# Altium schematic sheet MCU.SchDoc: Title
size A2; Date: Date; CompanyName: Integrated Micro-Electronics Bulgaria; Organization: Design & Development Department; Address1: Drawing Type; Address2: Address 1; Address3: Address 2; Address4: Address 3; DocumentNumber: 730xxx; Revision: 01; SheetNumber: 1; SheetTotal: 1; PageSetup: Record=PageOptions|CenterHorizontal=True|CenterVertical=True|PrintScale=0.70|XCorrection=1.00|YCorrection=1.00|PrintKind=2|BorderSize=5000000|LeftOffset=0|BottomOffset=0|Orientation=2|PaperLength=1000|PaperWidth=1000|Scale=100|PaperSource=7|PrintQuality=-4|MediaType=1|DitherType=10|PaperKind=A4|PrintScaleMode=1; SheetSize: A3; Time: Time; ModifiedDate: Mod. Date
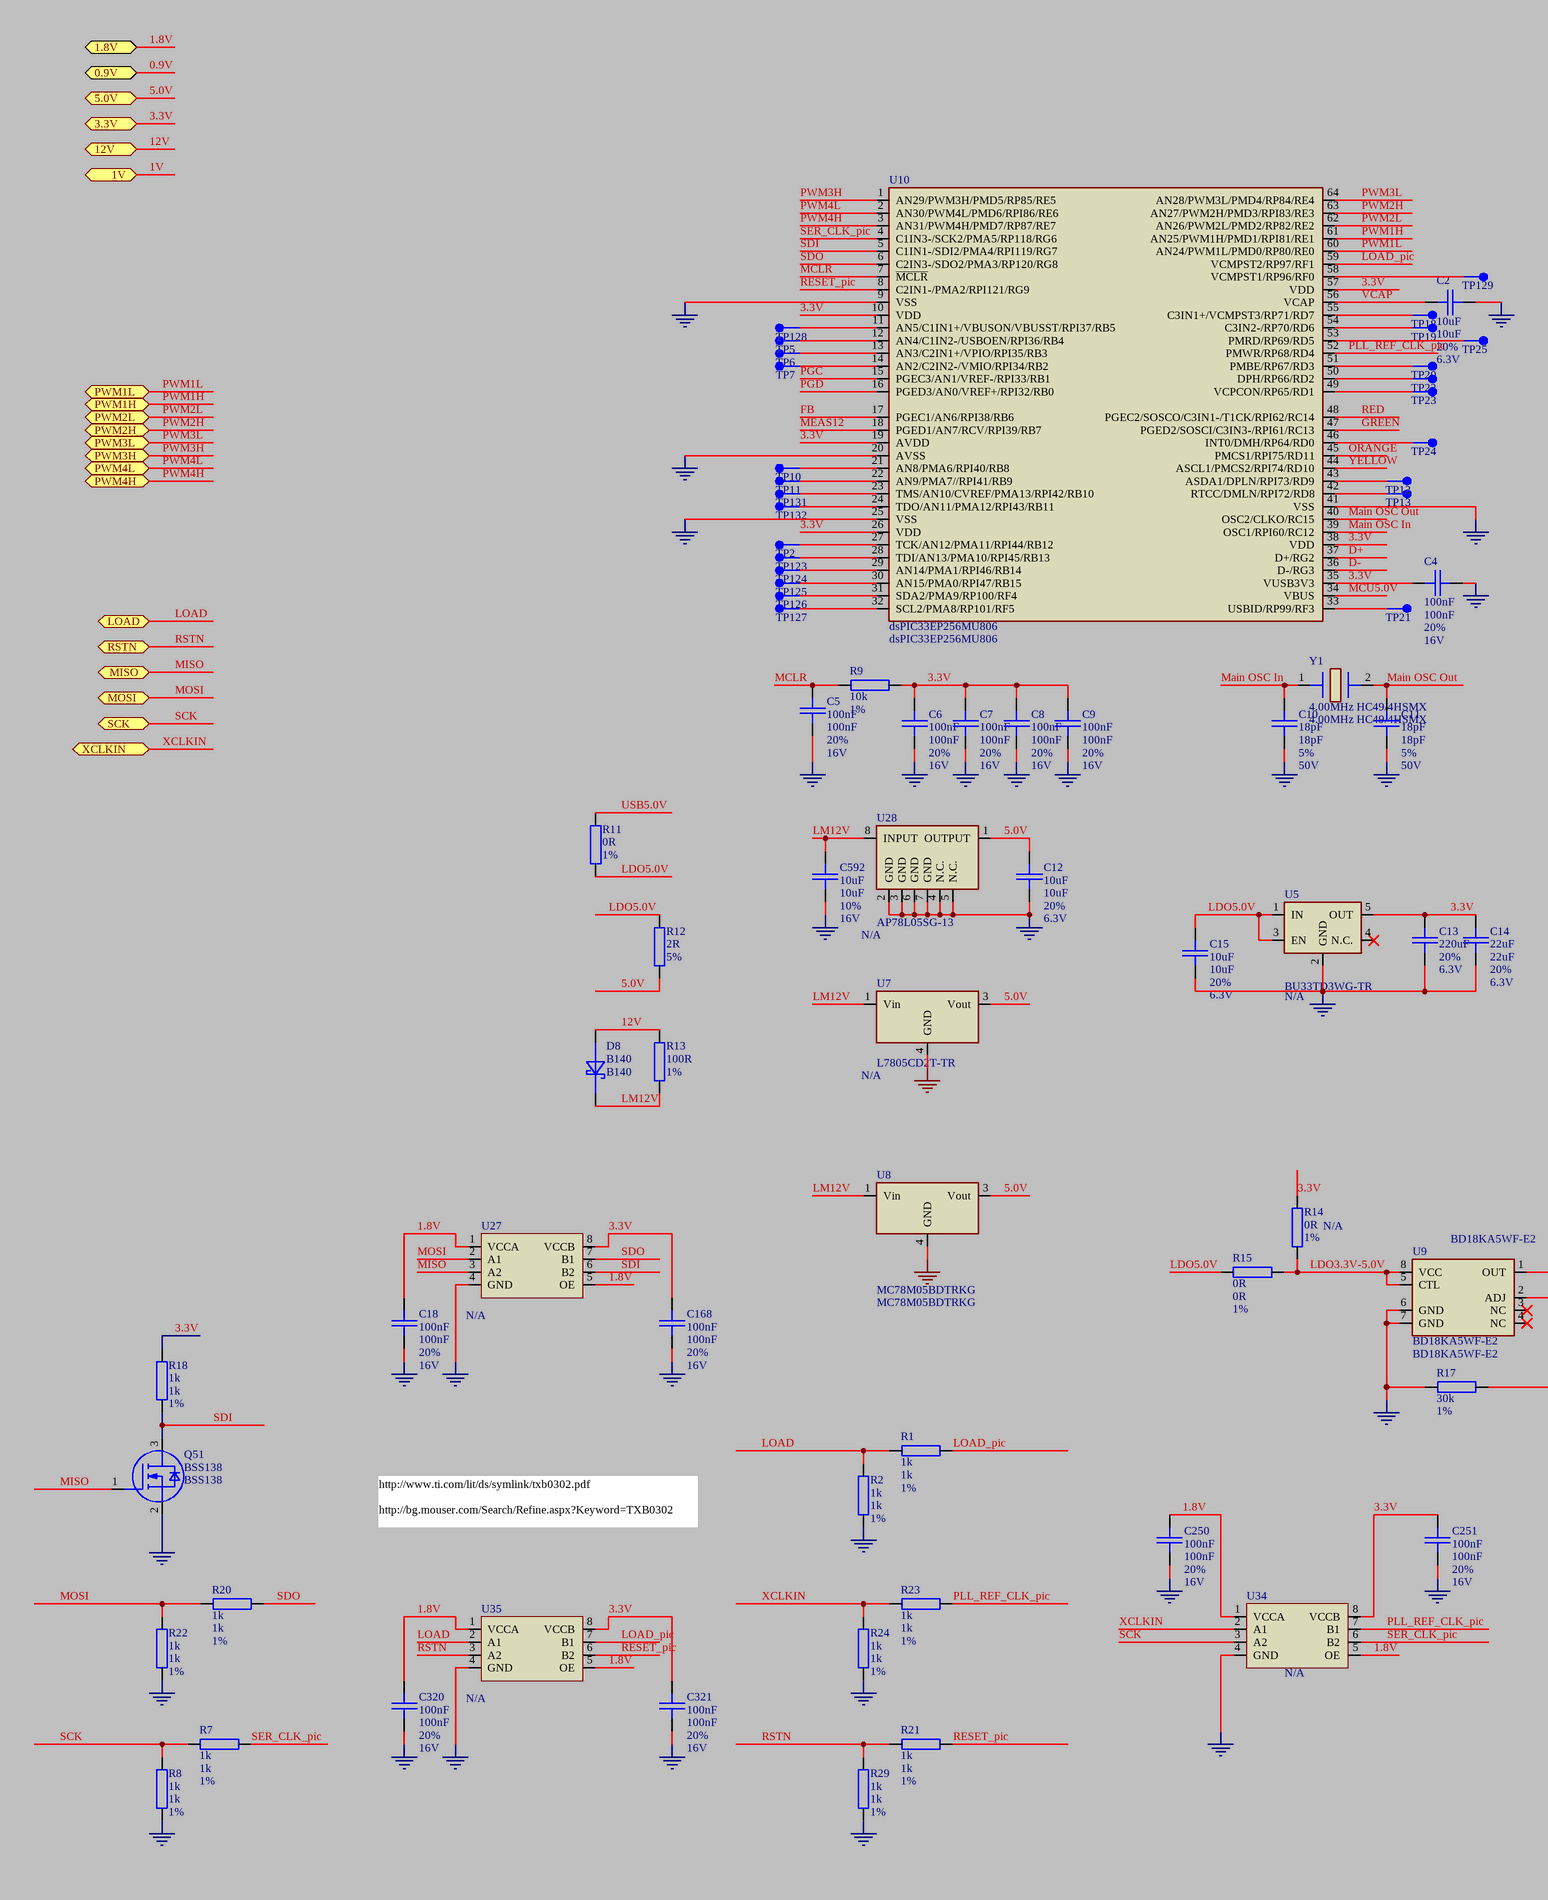
[diagram p0: MCU.SchDoc, left]
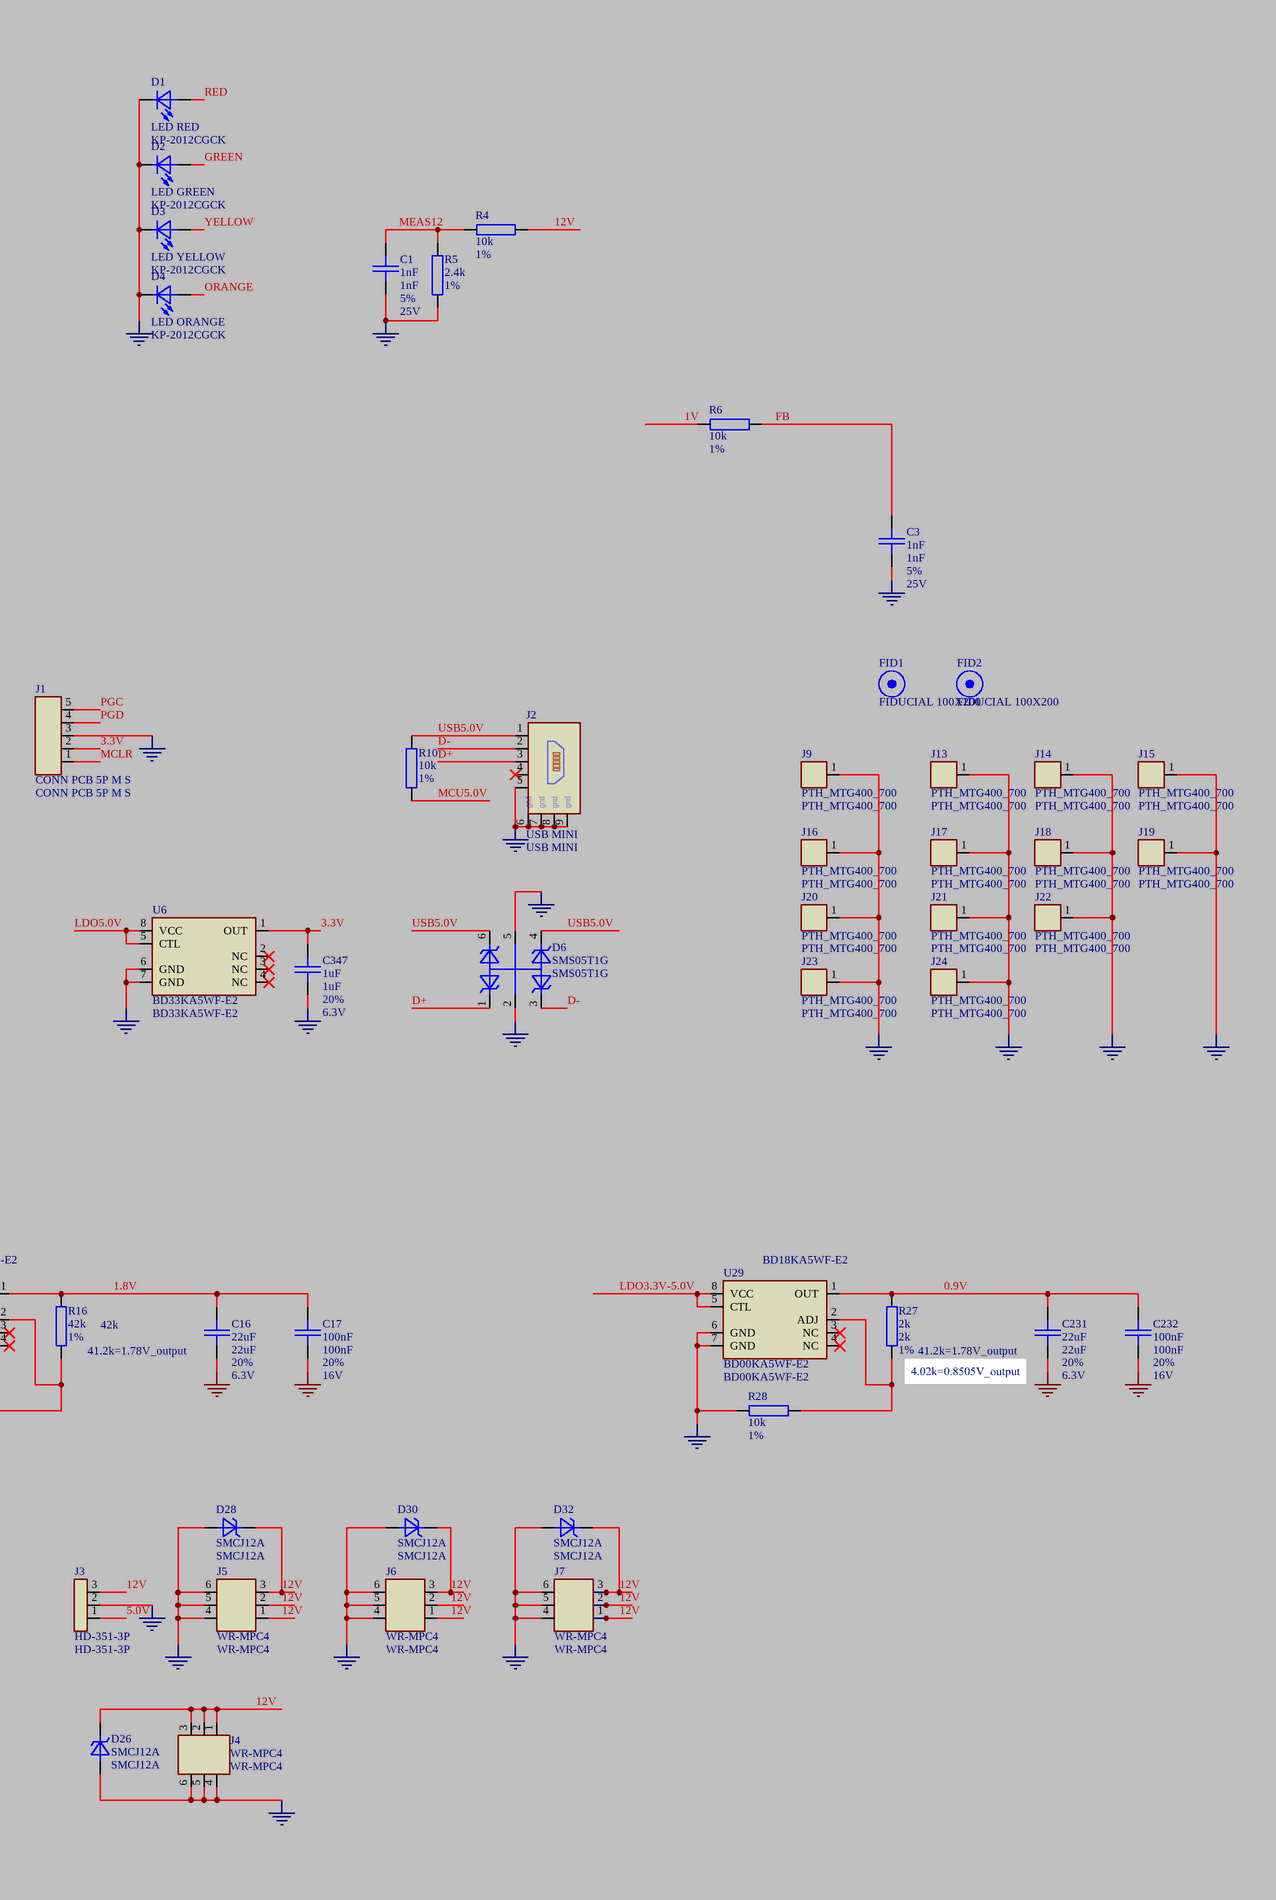
[diagram p1: MCU.SchDoc, right]

## Parts
C1  1nF  DB_TOLERANCE: 5%  DB_VOLTAGE: 25V  [SMD_0603_CAPC1608X95N]
C2  10uF  DB_TOLERANCE: 20%  DB_VOLTAGE: 6.3V  [SMD_0603_CAPC1608X95N]
C3  1nF  DB_TOLERANCE: 5%  DB_VOLTAGE: 25V  [SMD_0603_CAPC1608X95N]
C4  100nF  DB_TOLERANCE: 20%  DB_VOLTAGE: 16V  [SMD_0603_CAPC1608X95N]
C5  100nF  DB_TOLERANCE: 20%  DB_VOLTAGE: 16V  [SMD_0603_CAPC1608X95N]
C6  100nF  DB_TOLERANCE: 20%  DB_VOLTAGE: 16V  [SMD_0603_CAPC1608X95N]
C7  100nF  DB_TOLERANCE: 20%  DB_VOLTAGE: 16V  [SMD_0603_CAPC1608X95N]
C8  100nF  DB_TOLERANCE: 20%  DB_VOLTAGE: 16V  [SMD_0603_CAPC1608X95N]
C9  100nF  DB_TOLERANCE: 20%  DB_VOLTAGE: 16V  [SMD_0603_CAPC1608X95N]
C10  18pF  DB_TOLERANCE: 5%  DB_VOLTAGE: 50V  [SMD_0603_CAPC1608X95N]
C11  18pF  DB_TOLERANCE: 5%  DB_VOLTAGE: 50V  [SMD_0603_CAPC1608X95N]
C12  10uF  DB_TOLERANCE: 20%  DB_VOLTAGE: 6.3V  [SMD_0603_CAPC1608X95N]
C13  DB_TOLERANCE: 20%  DB_VOLTAGE: 6.3V  [SMD_1210_CAPC3225X279N]  (hidden comment: 220uF)
C14  22uF  DB_TOLERANCE: 20%  DB_VOLTAGE: 6.3V  [SMD_0805_CAPC2012X145N]
C15  10uF  DB_TOLERANCE: 20%  DB_VOLTAGE: 6.3V  [SMD_0603_CAPC1608X95N]
C16  22uF  DB_TOLERANCE: 20%  DB_VOLTAGE: 6.3V  [SMD_0805_CAPC2012X145N]
C17  100nF  DB_TOLERANCE: 20%  DB_VOLTAGE: 16V  [SMD_0603_CAPC1608X95N]
C18  100nF  DB_TOLERANCE: 20%  DB_VOLTAGE: 16V  [SMD_0603_CAPC1608X95N]
C168  100nF  DB_TOLERANCE: 20%  DB_VOLTAGE: 16V  [SMD_0603_CAPC1608X95N]
C231  22uF  DB_TOLERANCE: 20%  DB_VOLTAGE: 6.3V  [SMD_0805_CAPC2012X145N]
C232  100nF  DB_TOLERANCE: 20%  DB_VOLTAGE: 16V  [SMD_0603_CAPC1608X95N]
C250  100nF  DB_TOLERANCE: 20%  DB_VOLTAGE: 16V  [SMD_0603_CAPC1608X95N]
C251  100nF  DB_TOLERANCE: 20%  DB_VOLTAGE: 16V  [SMD_0603_CAPC1608X95N]
C320  100nF  DB_TOLERANCE: 20%  DB_VOLTAGE: 16V  [SMD_0603_CAPC1608X95N]
C321  100nF  DB_TOLERANCE: 20%  DB_VOLTAGE: 16V  [SMD_0603_CAPC1608X95N]
C347  1uF  DB_TOLERANCE: 20%  DB_VOLTAGE: 6.3V  [SMD_0603_CAPC1608X95N]
C592  10uF  DB_TOLERANCE: 10%  DB_VOLTAGE: 16V  [SMD_0805_CAPC2012X145N]
D1  LED RED  DB_VALUE: KP-2012CGCK  [SMD_0805_LED2012X100N]
D2  LED GREEN  DB_VALUE: KP-2012CGCK  [SMD_0805_LED2012X100N]
D3  LED YELLOW  DB_VALUE: KP-2012CGCK  [SMD_0805_LED2012X100N]
D4  LED ORANGE  DB_VALUE: KP-2012CGCK  [SMD_0805_LED2012X100N]
D6  SMS05T1G  [SMD_SOT457_SOT95P275X110-6N]
D8  B140  [SMD_DO214AC_SMA]
D26  SMCJ12A  [SMD_DO214AC_SMC]
D28  SMCJ12A  [SMD_DO214AC_SMC]
D30  SMCJ12A  [SMD_DO214AC_SMC]
D32  SMCJ12A  [SMD_DO214AC_SMC]
FID1  FIDUCIAL 100X200  [FID100X200]
FID2  FIDUCIAL 100X200  [FID100X200]
J1  CONN PCB 5P M S  [PTH_HDRV05W64P254_1X05]
J2  USB MINI  [SMD_CON-CVILUX-CU04-SCM15B0]
J3  HD-351-3P  [PTH_CON_HD-351-3P]
J4  WR-MPC4  [PTH_CON_WR-MRC4-6P]
J5  WR-MPC4  [PTH_CON_WR-MRC4-6P]
J6  WR-MPC4  [PTH_CON_WR-MRC4-6P]
J7  WR-MPC4  [PTH_CON_WR-MRC4-6P]
J9  PTH_MTG400_700  [PTH_MTG400_700]
J13  PTH_MTG400_700  [PTH_MTG400_700]
J14  PTH_MTG400_700  [PTH_MTG400_700]
J15  PTH_MTG400_700  [PTH_MTG400_700]
J16  PTH_MTG400_700  [PTH_MTG400_700]
J17  PTH_MTG400_700  [PTH_MTG400_700]
J18  PTH_MTG400_700  [PTH_MTG400_700]
J19  PTH_MTG400_700  [PTH_MTG400_700]
J20  PTH_MTG400_700  [PTH_MTG400_700]
J21  PTH_MTG400_700  [PTH_MTG400_700]
J22  PTH_MTG400_700  [PTH_MTG400_700]
J23  PTH_MTG400_700  [PTH_MTG400_700]
J24  PTH_MTG400_700  [PTH_MTG400_700]
Q51  BSS138  [SMD_SOT23_SOT95P240X112-3N]
R1  1k  DB_TOLERANCE: 1%  [SMD_0603_RESC1608X55N]
R2  1k  DB_TOLERANCE: 1%  [SMD_0603_RESC1608X55N]
R4  DB_TOLERANCE: 1%  [SMD_0603_RESC1608X55N]  (hidden comment: 10k)
R5  DB_TOLERANCE: 1%  [SMD_0603_RESC1608X55N]  (hidden comment: 2.4k)
R6  DB_TOLERANCE: 1%  [SMD_0603_RESC1608X55N]  (hidden comment: 10k)
R7  1k  DB_TOLERANCE: 1%  [SMD_0603_RESC1608X55N]
R8  1k  DB_TOLERANCE: 1%  [SMD_0603_RESC1608X55N]
R9  DB_TOLERANCE: 1%  [SMD_0603_RESC1608X55N]  (hidden comment: 10k)
R10  DB_TOLERANCE: 1%  [SMD_0603_RESC1608X55N]  (hidden comment: 10k)
R11  DB_TOLERANCE: 1%  [SMD_0603_RESC1608X55N]  (hidden comment: 0R)
R12  DB_TOLERANCE: 5%  [SMD_1206_RESC3216X65N]  (hidden comment: 2R)
R13  DB_TOLERANCE: 1%  [SMD_1206_RESC3216X65N]  (hidden comment: 100R)
R14  DB_TOLERANCE: 1%  [SMD_1206_RESC3216X65N]  (hidden comment: 0R)
R15  0R  DB_TOLERANCE: 1%  [SMD_1206_RESC3216X65N]
R16  DB_TOLERANCE: 1%  [SMD_0603_RESC1608X55N]  (hidden comment: 42k)
R17  DB_TOLERANCE: 1%  [SMD_0603_RESC1608X55N]  (hidden comment: 30k)
R18  1k  DB_TOLERANCE: 1%  [SMD_0603_RESC1608X55N]
R20  1k  DB_TOLERANCE: 1%  [SMD_0603_RESC1608X55N]
R21  1k  DB_TOLERANCE: 1%  [SMD_0603_RESC1608X55N]
R22  1k  DB_TOLERANCE: 1%  [SMD_0603_RESC1608X55N]
R23  1k  DB_TOLERANCE: 1%  [SMD_0603_RESC1608X55N]
R24  1k  DB_TOLERANCE: 1%  [SMD_0603_RESC1608X55N]
R27  2k  DB_TOLERANCE: 1%  [SMD_0603_RESC1608X55N]
R28  DB_TOLERANCE: 1%  [SMD_0603_RESC1608X55N]  (hidden comment: 10k)
R29  1k  DB_TOLERANCE: 1%  [SMD_0603_RESC1608X55N]
TP2  100_254  [SMD_TP_100-254]  (value not drawn)
TP5  100_254  [SMD_TP_100-254]  (value not drawn)
TP6  100_254  [SMD_TP_100-254]  (value not drawn)
TP7  100_254  [SMD_TP_100-254]  (value not drawn)
TP10  100_254  [SMD_TP_100-254]  (value not drawn)
TP11  100_254  [SMD_TP_100-254]  (value not drawn)
TP12  100_254  [SMD_TP_100-254]  (value not drawn)
TP13  100_254  [SMD_TP_100-254]  (value not drawn)
TP18  100_254  [SMD_TP_100-254]  (value not drawn)
TP19  100_254  [SMD_TP_100-254]  (value not drawn)
TP20  100_254  [SMD_TP_100-254]  (value not drawn)
TP21  100_254  [SMD_TP_100-254]  (value not drawn)
TP22  100_254  [SMD_TP_100-254]  (value not drawn)
TP23  100_254  [SMD_TP_100-254]  (value not drawn)
TP24  100_254  [SMD_TP_100-254]  (value not drawn)
TP25  100_254  [SMD_TP_100-254]  (value not drawn)
TP123  100_254  [SMD_TP_100-254]  (value not drawn)
TP124  100_254  [SMD_TP_100-254]  (value not drawn)
TP125  100_254  [SMD_TP_100-254]  (value not drawn)
TP126  100_254  [SMD_TP_100-254]  (value not drawn)
TP127  100_254  [SMD_TP_100-254]  (value not drawn)
TP128  100_254  [SMD_TP_100-254]  (value not drawn)
TP129  100_254  [SMD_TP_100-254]  (value not drawn)
TP131  100_254  [SMD_TP_100-254]  (value not drawn)
TP132  100_254  [SMD_TP_100-254]  (value not drawn)
U5  BU33TD3WG-TR  [SMD_SOT95P280X135-5N]
U6  BD33KA5WF-E2  [SMD_SOIC127P620X160-8N]
U7  L7805CD2T-TR  [SMD_TO254P1542X460-3_4N]
U8  MC78M05BDTRKG  [SMD_TO229P991X239-4N_DPAK]
U9  BD18KA5WF-E2  [SMD_SOIC127P620X160-8N]
U10  dsPIC33EP256MU806  [SMD_QFP50P1200X1200X120-64N]
U27  (no value)  [SMD_PSON40P120X180X40-8N]
U28  AP78L05SG-13  [SMD_SOIC127P600X175-8N]
U29  BD00KA5WF-E2  [SMD_SOIC127P620X160-8N]
U34  (no value)  [SMD_PSON40P120X180X40-8N]
U35  (no value)  [SMD_PSON40P120X180X40-8N]
Y1  4.00MHz HC49/4HSMX  [SMD_HC49_XTAL1140X480X420N]

## Ports
0.9V, 1.8V, 1V, 3.3V, 5.0V, 12V, LOAD, MISO, MOSI, PWM1H, PWM1L, PWM2H, PWM2L, PWM3H, PWM3L, PWM4H, PWM4L, RSTN, SCK, XCLKIN

## Nets
GND: C1.2 C2.2 C3.2 C4.2 C5.2 C6.2 C7.2 C8.2 C9.2 C10.2 C11.2 C12.2 C13.1 C14.2 C15.2 C16.2 C17.2 C18.1 C168.1 C231.2 C232.2 C250.1 C251.1 C320.1 C321.1 C347.2 C592.2 D1.1(C) D2.1(C) D3.1(C) D4.1(C) D6.2 D6.5 D26.2(A) D28.2(A) D30.2(A) D32.2(A) J1.3 J2.5 J2.6 J2.7 J2.8 J2.9 J3.2 J4.4 J4.5 J4.6 J5.4 J5.5 J5.6 J6.4 J6.5 J6.6 J7.4 J7.5 J7.6 J9.1 J13.1 J14.1 J15.1 J16.1 J17.1 J18.1 J19.1 J20.1 J21.1 J22.1 J23.1 J24.1 Q51.2(S) R2.2 R5.1 R8.2 R17.2 R22.2 R24.2 R28.2 R29.2 U5.2(GND) U6.6(GND) U6.7(GND) U7.4(GND) U8.4(GND) U9.6(GND) U9.7(GND) U10.9(VSS) U10.20(AVSS) U10.25(VSS) U10.41(VSS) U27.4(GND) U28.2(GND) U28.3(GND) U28.4(N.C.) U28.5(N.C.) U28.6(GND) U28.7(GND) U29.6(GND) U29.7(GND) U34.4(GND) U35.4(GND)
0.9V: C231.1 C232.1 R27.1 U29.1(OUT) ; port 0.9V
1.8V: C16.1 C17.1 C18.2 C250.2 C320.2 R16.1 U9.1(OUT) U27.1(VCCA) U27.5(OE) U34.1(VCCA) U34.5(OE) U35.1(VCCA) U35.5(OE) ; port 1.8V
1V: R6.2 ; port 1V
3.3V: C4.1 C6.1 C7.1 C8.1 C9.1 C13.2 C14.1 C168.2 C251.2 C321.2 C347.1 J1.2 R9.2 R14.2 R18.1 U5.5(OUT) U6.1(OUT) U10.10(VDD) U10.19(AVDD) U10.26(VDD) U10.35(VUSB3V3) U10.38(VDD) U10.57(VDD) U27.8(VCCB) U34.8(VCCB) U35.8(VCCB) ; port 3.3V
5.0V: C12.1 J3.1 R12.1 U7.3(Vout) U8.3(Vout) U28.1(OUTPUT) ; port 5.0V
12V: D8.2(A) D26.1(C) D28.1(C) D30.1(C) D32.1(C) J3.3 J4.1 J4.2 J4.3 J5.1 J5.2 J5.3 J6.1 J6.2 J6.3 J7.1 J7.2 J7.3 R4.1 R13.2 ; port 12V
D+: D6.1 J2.3 U10.37(D+/RG2)
D-: D6.3 J2.2 U10.36(D-/RG3)
FB: C3.1 R6.1 U10.17(PGEC1/AN6/RPI38/RB6)
GREEN: D2.2(A) U10.47(PGED2/SOSCI/C3IN3-/RPI61/RC13)
LDO3.3V-5.0V: R14.1 R15.1 U9.5(CTL) U9.8(VCC) U29.5(CTL) U29.8(VCC)
LDO5.0V: C15.1 R11.1 R12.2 R15.2 U5.1(IN) U5.3(EN) U6.5(CTL) U6.8(VCC)
LM12V: C592.1 D8.1(C) R13.1 U7.1(Vin) U8.1(Vin) U28.8(INPUT)
LOAD: R1.1 R2.1 U35.2(A1) ; port LOAD
LOAD_pic: R1.2 U10.59(VCMPST2/RP97/RF1) U35.7(B1)
Main OSC In: C10.1 U10.39(OSC1/RPI60/RC12) Y1.1
Main OSC Out: C11.1 U10.40(OSC2/CLKO/RC15) Y1.2
MCLR: C5.1 J1.1 R9.1 U10.7(~{MCLR})
MCU5.0V: R10.2 U10.34(VBUS)
MEAS12: C1.1 R4.2 R5.2 U10.18(PGED1/AN7/RCV/RPI39/RB7)
MISO: Q51.1(G) U27.3(A2) ; port MISO
MOSI: R20.1 R22.1 U27.2(A1) ; port MOSI
ORANGE: D4.2(A) U10.45(PMCS1/RPI75/RD11)
PGC: J1.5 U10.15(PGEC3/AN1/VREF-/RPI33/RB1)
PGD: J1.4 U10.16(PGED3/AN0/VREF+/RPI32/RB0)
PLL_REF_CLK_pic: R23.2 U10.52(PMWR/RP68/RD4) U34.7(B1)
PWM1H: U10.61(AN25/PWM1H/PMD1/RPI81/RE1) ; port PWM1H
PWM1L: U10.60(AN24/PWM1L/PMD0/RP80/RE0) ; port PWM1L
PWM2H: U10.63(AN27/PWM2H/PMD3/RPI83/RE3) ; port PWM2H
PWM2L: U10.62(AN26/PWM2L/PMD2/RP82/RE2) ; port PWM2L
PWM3H: U10.1(AN29/PWM3H/PMD5/RP85/RE5) ; port PWM3H
PWM3L: U10.64(AN28/PWM3L/PMD4/RP84/RE4) ; port PWM3L
PWM4H: U10.3(AN31/PWM4H/PMD7/RP87/RE7) ; port PWM4H
PWM4L: U10.2(AN30/PWM4L/PMD6/RPI86/RE6) ; port PWM4L
RED: D1.2(A) U10.48(PGEC2/SOSCO/C3IN1-/T1CK/RPI62/RC14)
RESET_pic: R21.2 U10.8(C2IN1-/PMA2/RPI121/RG9) U35.6(B2)
RSTN: R21.1 R29.1 U35.3(A2) ; port RSTN
SCK: R7.1 R8.1 U34.3(A2) ; port SCK
SDI: Q51.3(D) R18.2 U10.5(C1IN1-/SDI2/PMA4/RPI119/RG7) U27.6(B2)
SDO: R20.2 U10.6(C2IN3-/SDO2/PMA3/RP120/RG8) U27.7(B1)
SER_CLK_pic: R7.2 U10.4(C1IN3-/SCK2/PMA5/RP118/RG6) U34.6(B2)
USB5.0V: D6.4 D6.6 J2.1 R10.1 R11.2
VCAP: C2.1 U10.56(VCAP)
XCLKIN: R23.1 R24.1 U34.2(A1) ; port XCLKIN
YELLOW: D3.2(A) U10.44(ASCL1/PMCS2/RPI74/RD10)
NetR16_2: R16.2 R17.1 U9.2(ADJ)
NetR27_2: R27.2 R28.1 U29.2(ADJ)
NetTP2_1: TP2.1 U10.27(TCK/AN12/PMA11/RPI44/RB12)
NetTP5_1: TP5.1 U10.12(AN4/C1IN2-/USBOEN/RPI36/RB4)
NetTP6_1: TP6.1 U10.13(AN3/C2IN1+/VPIO/RPI35/RB3)
NetTP7_1: TP7.1 U10.14(AN2/C2IN2-/VMIO/RPI34/RB2)
NetTP10_1: TP10.1 U10.21(AN8/PMA6/RPI40/RB8)
NetTP11_1: TP11.1 U10.22(AN9/PMA7//RPI41/RB9)
NetTP12_1: TP12.1 U10.43(ASDA1/DPLN/RPI73/RD9)
NetTP13_1: TP13.1 U10.42(RTCC/DMLN/RPI72/RD8)
NetTP18_1: TP18.1 U10.55(C3IN1+/VCMPST3/RP71/RD7)
NetTP19_1: TP19.1 U10.54(C3IN2-/RP70/RD6)
NetTP20_1: TP20.1 U10.51(PMBE/RP67/RD3)
NetTP21_1: TP21.1 U10.33(USBID/RP99/RF3)
NetTP22_1: TP22.1 U10.50(DPH/RP66/RD2)
NetTP23_1: TP23.1 U10.49(VCPCON/RP65/RD1)
NetTP24_1: TP24.1 U10.46(INT0/DMH/RP64/RD0)
NetTP25_1: TP25.1 U10.53(PMRD/RP69/RD5)
NetTP123_1: TP123.1 U10.28(TDI/AN13/PMA10/RPI45/RB13)
NetTP124_1: TP124.1 U10.29(AN14/PMA1/RPI46/RB14)
NetTP125_1: TP125.1 U10.30(AN15/PMA0/RPI47/RB15)
NetTP126_1: TP126.1 U10.31(SDA2/PMA9/RP100/RF4)
NetTP127_1: TP127.1 U10.32(SCL2/PMA8/RP101/RF5)
NetTP128_1: TP128.1 U10.11(AN5/C1IN1+/VBUSON/VBUSST/RPI37/RB5)
NetTP129_1: TP129.1 U10.58(VCMPST1/RP96/RF0)
NetTP131_1: TP131.1 U10.23(TMS/AN10/CVREF/PMA13/RPI42/RB10)
NetTP132_1: TP132.1 U10.24(TDO/AN11/PMA12/RPI43/RB11)

Not connected (* = marked no-connect by the designer): J2 4*; U5 4(N.C.)*; U6 2(NC)* 3(NC)* 4(NC)*; U9 3(NC)* 4(NC)*; U29 3(NC)* 4(NC)*

## Notes on the sheet
- (near U9) BD18KA5WF-E2
- (near U29) BD18KA5WF-E2
- (near R16) 42k
- 41.2k=1.78V_output
- http://www.ti.com/lit/ds/symlink/txb0302.pdf
  http://bg.mouser.com/Search/Refine.aspx?Keyword=TXB0302
- (in symbol CON000000048) gnd

## Library data of the parts
C1 C3 = CAP000024113: DB_PART_TYPE: Ceramic_SMD\Standard_X7R; DB_MANUFACTURER_PART: KEMET    C0603C102J3RAC; NOTE: <NOTE>; DB_T_RANGE: -55 to 125; DB_PACKAGE: 0603; DB_DESCRIPTION: C X7R 1nF 5% 25V 0603; DB_CERTIFIED: ISHIDDEN=T; DB_APPROVED_ON: 09.10.2010 г.; DB_STATUS: NEW; DB_PART_NUMBER: CAP000024113; DB_VALUE: 1nF; DB_PCB_DEVICE: SMD_0603_CAPC1608X95N; DB_PRICE: ISHIDDEN=T; DB_LEADTIME: ISHIDDEN=T; DB_MOQ: ISHIDDEN=T; DB_PRICE_DATE: ISHIDDEN=T; DB_APPROVED_BY: ISHIDDEN=T; DB_DATASHEET: http://john.epiqdesign.com/projects/CIS_Datasheets/F3102_CE_Kemet.pdf?rev=92&sc=0
C2 C12 C15 = CAP000043646: DB_MANUFACTURER_PART: KEMET    C0603C106M9PAC; DB_PART_TYPE: Ceramic_SMD\Standard_X5R; NOTE: <NOTE>; DB_APPROVED_BY: ISHIDDEN=T; DB_APPROVED_ON: 09.10.2010 г.; DB_DESCRIPTION: C X5R 10uF 20% 6.3V 0603; DB_PACKAGE: 0603; DB_STATUS: NEW; DB_T_RANGE: -55 to 85; DB_PART_NUMBER: CAP000043646; DB_VALUE: 10uF; DB_CERTIFIED: ISHIDDEN=T; DB_DATASHEET: http://john.epiqdesign.com/projects/CIS_Datasheets/F3102_CE_Kemet.pdf?rev=92&sc=0; DB_LEADTIME: ISHIDDEN=T; DB_MOQ: ISHIDDEN=T; DB_PCB_DEVICE: SMD_0603_CAPC1608X95N; DB_PRICE: ISHIDDEN=T; DB_PRICE_DATE: ISHIDDEN=T
C4-C9 C17 C18 C168 C232 C250 C251 C320 C321 = CAP000027236: DB_MANUFACTURER_PART: KEMET    C0603C104M4RAC; DB_PART_TYPE: Ceramic_SMD\Standard_X7R; NOTE: <NOTE>; DB_APPROVED_BY: ISHIDDEN=T; DB_APPROVED_ON: 09.10.2010 г.; DB_DESCRIPTION: C X7R 100nF 20% 16V 0603; DB_PACKAGE: 0603; DB_STATUS: NEW; DB_T_RANGE: -55 to 125; DB_PART_NUMBER: CAP000027236; DB_VALUE: 100nF; DB_CERTIFIED: ISHIDDEN=T; DB_DATASHEET: http://john.epiqdesign.com/projects/CIS_Datasheets/F3102_CE_Kemet.pdf?rev=92&sc=0; DB_LEADTIME: ISHIDDEN=T; DB_MOQ: ISHIDDEN=T; DB_PCB_DEVICE: SMD_0603_CAPC1608X95N; DB_PRICE: ISHIDDEN=T; DB_PRICE_DATE: ISHIDDEN=T
C10 C11 = CAP000031922: DB_PART_TYPE: Ceramic_SMD\Standard_C0G; DB_MANUFACTURER_PART: KEMET    C0603C180J5GAC; NOTE: <NOTE>; DB_T_RANGE: -55 to 125; DB_PACKAGE: 0603; DB_DESCRIPTION: C C0G 18pF 5% 50V 0603; DB_CERTIFIED: ISHIDDEN=T; DB_APPROVED_ON: 09.10.2010 г.; DB_STATUS: NEW; DB_PART_NUMBER: CAP000031922; DB_VALUE: 18pF; DB_PCB_DEVICE: SMD_0603_CAPC1608X95N; DB_PRICE: ISHIDDEN=T; DB_LEADTIME: ISHIDDEN=T; DB_MOQ: ISHIDDEN=T; DB_PRICE_DATE: ISHIDDEN=T; DB_APPROVED_BY: ISHIDDEN=T; DB_DATASHEET: http://john.epiqdesign.com/projects/CIS_Datasheets/F3102_CE_Kemet.pdf?rev=92&sc=0
C13 = CAP000047355: DB_PART_TYPE: Ceramic_SMD\Standard_X5R; DB_MANUFACTURER_PART: SAMSUNG    CL32A227MQVNNNE; NOTE: <NOTE>; DB_T_RANGE: -55 to 85; DB_PACKAGE: 1210; DB_DESCRIPTION: C X5R 220uF 20% 6.3V 1210; DB_CERTIFIED: ISHIDDEN=T; DB_APPROVED_BY: VSN; DB_APPROVED_ON: 07.5.2014 г. 11:28:08; DB_STATUS: NEW; DB_PART_NUMBER: CAP000047355; DB_VALUE: 220uF; DB_PCB_DEVICE: SMD_1210_CAPC3225X279N; DB_DATASHEET: http://john.epiqdesign.com/projects/CIS_Datasheets/CAP_CL32A227MQVNNNE.pdf?rev=1401&sc=0
C14 C16 C231 = CAP000043686: DB_PART_TYPE: Ceramic_SMD\Standard_X5R; DB_MANUFACTURER_PART: KEMET    C0805C226M9PAC; NOTE: <NOTE>; DB_T_RANGE: -55 to 85; DB_PACKAGE: 0805; DB_DESCRIPTION: C X5R 22uF 20% 6.3V 0805; DB_CERTIFIED: ISHIDDEN=T; DB_APPROVED_ON: 09.10.2010 г.; DB_STATUS: NEW; DB_PART_NUMBER: CAP000043686; DB_VALUE: 22uF; DB_PCB_DEVICE: SMD_0805_CAPC2012X145N; DB_PRICE: ISHIDDEN=T; DB_LEADTIME: ISHIDDEN=T; DB_MOQ: ISHIDDEN=T; DB_PRICE_DATE: ISHIDDEN=T; DB_APPROVED_BY: ISHIDDEN=T; DB_DATASHEET: http://john.epiqdesign.com/projects/CIS_Datasheets/F3102_CE_Kemet.pdf?rev=92&sc=0
C347 = CAP000043344: DB_PART_TYPE: Ceramic_SMD\Standard_X5R; DB_MANUFACTURER_PART: KEMET    C0603C105M9PAC; NOTE: <NOTE>; DB_T_RANGE: -55 to 85; DB_PACKAGE: 0603; DB_DESCRIPTION: C X5R 1uF 20% 6.3V 0603; DB_CERTIFIED: ISHIDDEN=T; DB_APPROVED_ON: 09.10.2010 г.; DB_STATUS: NEW; DB_PART_NUMBER: CAP000043344; DB_VALUE: 1uF; DB_PCB_DEVICE: SMD_0603_CAPC1608X95N; DB_PRICE: ISHIDDEN=T; DB_LEADTIME: ISHIDDEN=T; DB_MOQ: ISHIDDEN=T; DB_PRICE_DATE: ISHIDDEN=T; DB_APPROVED_BY: ISHIDDEN=T; DB_DATASHEET: http://john.epiqdesign.com/projects/CIS_Datasheets/F3102_CE_Kemet.pdf?rev=92&sc=0
C592 = CAP000043636: DB_PART_TYPE: Ceramic_SMD\Standard_X5R; DB_MANUFACTURER_PART: KEMET    C0805C106K4PAC; NOTE: <NOTE>; DB_T_RANGE: -55 to 85; DB_PACKAGE: 0805; DB_DESCRIPTION: C X5R 10uF 10% 16V 0805; DB_CERTIFIED: ISHIDDEN=T; DB_APPROVED_ON: 09.10.2010 г.; DB_STATUS: NEW; DB_PART_NUMBER: CAP000043636; DB_VALUE: 10uF; DB_PCB_DEVICE: SMD_0805_CAPC2012X145N; DB_PRICE: ISHIDDEN=T; DB_LEADTIME: ISHIDDEN=T; DB_MOQ: ISHIDDEN=T; DB_PRICE_DATE: ISHIDDEN=T; DB_APPROVED_BY: ISHIDDEN=T; DB_DATASHEET: http://john.epiqdesign.com/projects/CIS_Datasheets/F3102_CE_Kemet.pdf?rev=92&sc=0
D1 D3 D4 = OPT000000096: DB_MANUFACTURER_PART: KINGBRIGHT       KP-2012CGCK; NOTE: <NOTE>; DB_T_RANGE: -40 to 85; DB_COLOUR: GREEN; DB_PACKAGE: 0805; DB_DESCRIPTION: LED GREEN 0805; DB_CERTIFIED: ISHIDDEN=T; DB_APPROVED_BY: VSN; DB_APPROVED_ON: 08.4.2014 г. 09:22:12; DB_STATUS: NEW; DB_PCB_DEVICE: SMD_0805_LED2012X100N; DB_PART_NUMBER: OPT000000096; DB_PART_TYPE: LED; DB_DATASHEET: http://john.epiqdesign.com/projects/CIS_Datasheets/LED_KP-2012CGCK_0805_GREEN.pdf?rev=1359&sc=0
D2 = OPT000000096: DB_MANUFACTURER_PART: KINGBRIGHT       KP-2012CGCK; NOTE: <NOTE>; DB_T_RANGE: -40 to 85; DB_PACKAGE: 0805; DB_DESCRIPTION: LED GREEN 0805; DB_CERTIFIED: ISHIDDEN=T; DB_APPROVED_BY: VSN; DB_APPROVED_ON: 08.4.2014 г. 09:22:12; DB_STATUS: NEW; DB_PCB_DEVICE: SMD_0805_LED2012X100N; DB_PART_NUMBER: OPT000000096; DB_PART_TYPE: LED; DB_COLOUR: GREEN; DB_DATASHEET: http://john.epiqdesign.com/projects/CIS_Datasheets/LED_KP-2012CGCK_0805_GREEN.pdf?rev=1359&sc=0
D6 = DDE000002846: DB_PART_TYPE: ESD protection; DB_MANUFACTURER_PART: ON SEMICONDUCTOR        SMS05T1G; DB_T_RANGE: -55 to 150; DB_VOLTAGE: 5V; DB_PACKAGE: SC-74; DB_DESCRIPTION: D SMS05T1G SC-74; DB_CERTIFIED: ISHIDDEN=T; DB_APPROVED_BY: VSN; DB_APPROVED_ON: 24.3.2014 г. 10:22:08; DB_STATUS: NEW; DB_PART_NUMBER: DDE000002846; DB_VALUE: SMS05T1G; DB_PCB_DEVICE: SMD_SOT457_SOT95P275X110-6N; DB_DATASHEET: http://john.epiqdesign.com/projects/CIS_Datasheets/IC_SMS05T1-D.pdf?rev=1323&sc=0
D8 = DDE000000580: DB_PART_TYPE: Schottky; DB_MANUFACTURER_PART: Diodes        B140; NOTE: <NOTE>; DB_T_RANGE: -65 to +150; DB_VOLTAGE: 40V; DB_CURRENT: 1A; DB_PACKAGE: SMA; DB_DESCRIPTION: D B140 SMA; DB_CERTIFIED: ISHIDDEN=T; DB_APPROVED_ON: 09.10.2010 г.; DB_STATUS: NEW; DB_PART_NUMBER: DDE000000580; DB_VALUE: B140; DB_PCB_DEVICE: SMD_DO214AC_SMA; DB_PRICE: ISHIDDEN=T; DB_LEADTIME: ISHIDDEN=T; DB_MOQ: ISHIDDEN=T; DB_PRICE_DATE: ISHIDDEN=T; DB_APPROVED_BY: ISHIDDEN=T; DB_DATASHEET: ISHIDDEN=T
D26 D28 D30 D32 = DDE000001725: DB_PART_TYPE: TVS; DB_MANUFACTURER_PART: Diodes        SMCJ12A; NOTE: <NOTE>; DB_T_RANGE: -55 to 150; DB_VOLTAGE: 12V; DB_CURRENT: 75A(Max); DB_PACKAGE: SMC; DB_DESCRIPTION: D SMCJ12A SMC; DB_CERTIFIED: ISHIDDEN=T; DB_APPROVED_ON: 09.10.2010 г.; DB_STATUS: NEW; DB_PART_NUMBER: DDE000001725; DB_VALUE: SMCJ12A; DB_PCB_DEVICE: SMD_DO214AC_SMC; DB_PRICE: ISHIDDEN=T; DB_LEADTIME: ISHIDDEN=T; DB_MOQ: ISHIDDEN=T; DB_PRICE_DATE: ISHIDDEN=T; DB_APPROVED_BY: ISHIDDEN=T; DB_DATASHEET: ISHIDDEN=T
FID1 FID2 = FID000000001: NOTE: <NOTE>; DB_PACKAGE: ISHIDDEN=T; DB_APPROVED_ON: 10.9.2010 г.; DB_STATUS: NEW; DB_PART_NUMBER: FID000000001; DB_PART_TYPE: FIDUCIAL; DB_VALUE: FIDUCIAL 100X200; DB_DIAMETER: 100X200; DB_DESCRIPTION: FIDUCIAL 100x200; DB_PCB_DEVICE: FID100X200; DB_MANUFACTURER_PART: ISHIDDEN=T; DB_CERTIFIED: ISHIDDEN=T; DB_PRICE: ISHIDDEN=T; DB_LEADTIME: ISHIDDEN=T; DB_MOQ: ISHIDDEN=T; DB_PRICE_DATE: ISHIDDEN=T; DB_APPROVED_BY: ISHIDDEN=T; DB_DATASHEET: ISHIDDEN=T
J1 = CON000000006: DB_PART_TYPE: Connector; DB_MANUFACTURER_PART: W+P        143-12-005-00; NOTE: <NOTE>; DB_PINS_NUMBER: ISHIDDEN=T; DB_T_RANGE: -55 to 125; DB_PACKAGE: PTH; DB_DESCRIPTION: CONN PCB 5P M S 143-12-005-00; DB_APPROVED_BY: VSN; DB_APPROVED_ON: 14.12.2010 г. 10:22:07; DB_STATUS: NEW; DB_PART_NUMBER: CON000000006; DB_VALUE: CONN PCB 5P M S; DB_PITCH: ISHIDDEN=T; DB_VOLTAGE: ISHIDDEN=T; DB_CURRENT: ISHIDDEN=T; DB_IP_CLASS: ISHIDDEN=T; DB_PCB_DEVICE: PTH_HDRV05W64P254_1X05; DB_CERTIFIED: ISHIDDEN=T; DB_PRICE: ISHIDDEN=T; DB_LEADTIME: ISHIDDEN=T; DB_MOQ: ISHIDDEN=T; DB_PRICE_DATE: ISHIDDEN=T; DB_DATASHEET: http://john.epiqdesign.com/projects/CIS_Datasheets/143-12-005-00_W+P.pdf?rev=3&sc=0
J2 = CON000000048: DB_PART_TYPE: Connector; DB_MANUFACTURER_PART: CVILUX       CU04-SCM15B0-R0-LF; NOTE: <NOTE>; DB_PINS_NUMBER: 5; DB_PITCH: 0.8; DB_PACKAGE: SMD; DB_DESCRIPTION: CONN  PCB  5P  F  A  USB5 MINI SMD; DB_CERTIFIED: ISHIDDEN=T; DB_APPROVED_BY: VSN; DB_APPROVED_ON: 02.5.2011 г. 10:29:38; DB_STATUS: NEW; DB_PART_NUMBER: CON000000048; DB_VALUE: USB MINI; DB_PCB_DEVICE: SMD_CON-CVILUX-CU04-SCM15B0; DB_PRICE: ISHIDDEN=T; DB_LEADTIME: ISHIDDEN=T; DB_MOQ: ISHIDDEN=T; DB_PRICE_DATE: ISHIDDEN=T; DB_DATASHEET: http://john.epiqdesign.com/projects/CIS_Datasheets/USB%20MINI_CVILUX.pdf?rev=249&sc=0
J3 = CON000000272: DB_PART_TYPE: Connector; DB_MANUFACTURER_PART: HOW DER      HD-351-3P; DB_PINS_NUMBER: 3; DB_PITCH: 3.5mm; DB_VOLTAGE: 300VAC; DB_CURRENT: 10A; DB_PACKAGE: PTH; DB_DESCRIPTION: CONN PCB 3P; DB_CERTIFIED: ISHIDDEN=T; DB_APPROVED_BY: VSN; DB_APPROVED_ON: 07.5.2014 г. 14:06:04; DB_STATUS: NEW; DB_PART_NUMBER: CON000000272; DB_VALUE: HD-351-3P; DB_PCB_DEVICE: PTH_CON_HD-351-3P; DB_DATASHEET: http://john.epiqdesign.com/projects/CIS_Datasheets/CON_hd-351.pdf?rev=1413&sc=0
J4-J7 = CON000000271: DB_PART_TYPE: Connector; DB_MANUFACTURER_PART: WE         649 006 295 22; DB_PINS_NUMBER: 6; DB_PITCH: 4.2mm; DB_T_RANGE: -40 to 105; DB_VOLTAGE: 600VAC; DB_CURRENT: 6 - 9A; DB_PACKAGE: PTH; DB_DESCRIPTION: CONN PCB 6P M A PTH; DB_CERTIFIED: ISHIDDEN=T; DB_APPROVED_BY: VSN; DB_STATUS: NEW; DB_PART_NUMBER: CON000000271; DB_VALUE: WR-MPC4; DB_PCB_DEVICE: PTH_CON_WR-MRC4-6P; DB_APPROVED_ON: 07.05.2014 13:56:56; DB_DATASHEET: http://john.epiqdesign.com/projects/CIS_Datasheets/CON_WR-MPC4.pdf?rev=1412&sc=0
J9 J13-J24 = MTH000000030: DB_PART_TYPE: Mounting Hole; NOTE: <NOTE>; DB_DIAMETER: 4mm; DB_PLATED: Yes; DB_DESCRIPTION: Mounting Hole PTH_MTG400_700; DB_CERTIFIED: ISHIDDEN=T; DB_APPROVED_BY: VSN; DB_APPROVED_ON: 02.4.2013 г. 15:54:43; DB_STATUS: NEW; DB_PART_NUMBER: MTH000000030; DB_VALUE: PTH_MTG400_700; DB_PCB_DEVICE: PTH_MTG400_700; DB_PRICE: ISHIDDEN=T; DB_LEADTIME: ISHIDDEN=T; DB_MOQ: ISHIDDEN=T; DB_PRICE_DATE: ISHIDDEN=T
Q51 = TRA000001460: DB_PART_TYPE: MOSFET\N_Channel; DB_MANUFACTURER_PART: FAIRCHILD        BSS138LT1G; NOTE: <NOTE>; DB_T_RANGE: -55 to 150; DB_VOLTAGE: 50V; DB_CURRENT: 0.22A; DB_PACKAGE: SOT-23-3; DB_DESCRIPTION: TRANS BSS138 SOT-23-3; DB_CERTIFIED: ISHIDDEN=T; DB_APPROVED_BY: VSN; DB_APPROVED_ON: 14.1.2011 г. 10:29:14; DB_STATUS: NEW; DB_PART_NUMBER: TRA000001460; DB_VALUE: BSS138; DB_PCB_DEVICE: SMD_SOT23_SOT95P240X112-3N; DB_PRICE: ISHIDDEN=T; DB_LEADTIME: ISHIDDEN=T; DB_MOQ: ISHIDDEN=T; DB_PRICE_DATE: ISHIDDEN=T; DB_DATASHEET: http://john.epiqdesign.com/projects/CIS_Datasheets/BSS138LT1-D_Fairchild.pdf?rev=55&sc=0
R1 R2 R7 R8 R18 R20-R24 R29 = RES000006252: DB_PART_TYPE: SMD; DB_MANUFACTURER_PART: YAGEO    RC0603FR-071K; NOTE: <NOTE>; DB_T_RANGE: -55 to 155; DB_POWER: 1/10W; DB_PACKAGE: 0603; DB_DESCRIPTION: R SMD 1K 1% 1/10W 0603; DB_CERTIFIED: ISHIDDEN=T; DB_PRICE: 0.00063; DB_MOQ: 5000; DB_APPROVED_ON: 09.10.2010 г.; DB_STATUS: NEW; R_BDS: R; DB_PART_NUMBER: RES000006252; DB_VALUE: 1k; DB_PCB_DEVICE: SMD_0603_RESC1608X55N; DB_PRICE_DATE: 2010-12-23; DB_APPROVED_BY: ISHIDDEN=T; DB_DATASHEET: http://john.epiqdesign.com/projects/CIS_Datasheets/PYu-RC0603_51_RoHS_L_4_YAGEO.pdf?rev=138&sc=0
R4 R6 R9 R10 R28 = RES000008663: DB_PART_TYPE: SMD; DB_MANUFACTURER_PART: YAGEO    RC0603FR-0710KL; NOTE: <NOTE>; DB_T_RANGE: -55 to 155; DB_POWER: 1/10W; DB_PACKAGE: 0603; DB_DESCRIPTION: R SMD 10k 1% 1/10W 0603; DB_CERTIFIED: ISHIDDEN=T; DB_APPROVED_BY: VSN; DB_APPROVED_ON: 08.8.2011 г. 08:31:51; DB_STATUS: NEW; R_BDS: R; DB_PART_NUMBER: RES000008663; DB_VALUE: 10k; DB_PCB_DEVICE: SMD_0603_RESC1608X55N; DB_PRICE: ISHIDDEN=T; DB_LEADTIME: ISHIDDEN=T; DB_MOQ: ISHIDDEN=T; DB_PRICE_DATE: ISHIDDEN=T; DB_DATASHEET: http://john.epiqdesign.com/projects/CIS_Datasheets/PYu-RC0603_51_RoHS_L_4_YAGEO.pdf?rev=138&sc=0
R5 = RES000006261: DB_PART_TYPE: SMD; DB_MANUFACTURER_PART: YAGEO    RC0603FR-072K4; NOTE: <NOTE>; DB_T_RANGE: -55 to 155; DB_POWER: 1/10W; DB_PACKAGE: 0603; DB_DESCRIPTION: R SMD 2K4 1% 1/10W 0603; DB_CERTIFIED: ISHIDDEN=T; DB_PRICE: 0.00063; DB_MOQ: 5000; DB_APPROVED_ON: 09.10.2010 г.; DB_STATUS: NEW; R_BDS: R; DB_PART_NUMBER: RES000006261; DB_VALUE: 2.4k; DB_PCB_DEVICE: SMD_0603_RESC1608X55N; DB_PRICE_DATE: 2010-12-23; DB_APPROVED_BY: ISHIDDEN=T; DB_DATASHEET: http://john.epiqdesign.com/projects/CIS_Datasheets/PYu-RC0603_51_RoHS_L_4_YAGEO.pdf?rev=138&sc=0
R11 = RES000008926: DB_PART_TYPE: SMD; DB_MANUFACTURER_PART: YAGEO    AC0603FR-070RL; NOTE: <NOTE>; DB_T_RANGE: -55 to 155; DB_POWER: 1/10W; DB_PACKAGE: 0603; DB_DESCRIPTION: R SMD 0R 1% 1/10W 0603; DB_CERTIFIED: AUT; DB_APPROVED_BY: VSN; DB_APPROVED_ON: 21.5.2013 г. 09:19:53; DB_STATUS: NEW; R_BDS: R; DB_PART_NUMBER: RES000008926; DB_VALUE: 0R; DB_PCB_DEVICE: SMD_0603_RESC1608X55N; DB_DATASHEET: http://john.epiqdesign.com/projects/CIS_Datasheets/RES_AC_YAGEO.pdf?rev=263&sc=0
R12 = RES000007051: DB_PART_TYPE: SMD; DB_MANUFACTURER_PART: YAGEO    RC1206JR-072R; NOTE: <NOTE>; DB_T_RANGE: -55 to 155; DB_POWER: 1/4W; DB_PACKAGE: 1206; DB_DESCRIPTION: R SMD 2R 5% 1/4W 1206; DB_CERTIFIED: ISHIDDEN=T; DB_APPROVED_ON: 09.10.2010 г.; DB_STATUS: NEW; R_BDS: R; DB_PART_NUMBER: RES000007051; DB_VALUE: 2R; DB_PCB_DEVICE: SMD_1206_RESC3216X65N; DB_PRICE: ISHIDDEN=T; DB_LEADTIME: ISHIDDEN=T; DB_MOQ: ISHIDDEN=T; DB_PRICE_DATE: ISHIDDEN=T; DB_APPROVED_BY: ISHIDDEN=T; DB_DATASHEET: http://john.epiqdesign.com/projects/CIS_Datasheets/PYu-RC1206_51_RoHS_L_4_YAGEO.pdf?rev=138&sc=0
R13 = RES000006922: DB_PART_TYPE: SMD; DB_MANUFACTURER_PART: YAGEO    RC1206FR-07100R; NOTE: <NOTE>; DB_T_RANGE: -55 to 155; DB_POWER: 1/4W; DB_PACKAGE: 1206; DB_DESCRIPTION: R SMD 100R 1% 1/4W 1206; DB_CERTIFIED: ISHIDDEN=T; DB_APPROVED_ON: 09.10.2010 г.; DB_STATUS: NEW; R_BDS: R; DB_PART_NUMBER: RES000006922; DB_VALUE: 100R; DB_PCB_DEVICE: SMD_1206_RESC3216X65N; DB_PRICE: ISHIDDEN=T; DB_LEADTIME: ISHIDDEN=T; DB_MOQ: ISHIDDEN=T; DB_PRICE_DATE: ISHIDDEN=T; DB_APPROVED_BY: ISHIDDEN=T; DB_DATASHEET: http://john.epiqdesign.com/projects/CIS_Datasheets/PYu-RC1206_51_RoHS_L_4_YAGEO.pdf?rev=138&sc=0
R14 R15 = RES000008756: DB_PART_TYPE: SMD; DB_MANUFACTURER_PART: YAGEO    AC1206FR-070RL; NOTE: <NOTE>; DB_T_RANGE: -55 to 155; DB_POWER: 1/4W; DB_PACKAGE: 1206; DB_DESCRIPTION: R SMD 0R 1% 1/4W 1206; DB_CERTIFIED: AUT; DB_PRICE: ISHIDDEN=T; DB_APPROVED_BY: VSN; DB_APPROVED_ON: 27.4.2012 г. 12:25:00; DB_STATUS: NEW; R_BDS: R; DB_PART_NUMBER: RES000008756; DB_VALUE: 0R; DB_PCB_DEVICE: SMD_1206_RESC3216X65N; DB_LEADTIME: ISHIDDEN=T; DB_MOQ: ISHIDDEN=T; DB_PRICE_DATE: ISHIDDEN=T; DB_DATASHEET: http://john.epiqdesign.com/projects/CIS_Datasheets/RES_AC_YAGEO.pdf?rev=263&sc=0
  R14: Assembly: N/A
R16 = RES000001590: DB_PART_TYPE: SMD; DB_MANUFACTURER_PART: YAGEO    RC0603FR-0741K2; NOTE: <NOTE>; DB_T_RANGE: -55 to 155; DB_POWER: 1/10W; DB_PACKAGE: 0603; DB_DESCRIPTION: R SMD 41K2 1% 1/10W 0603; DB_CERTIFIED: ISHIDDEN=T; DB_PRICE: 0.00063; DB_MOQ: 5000; DB_APPROVED_ON: 09.10.2010 г.; DB_STATUS: NEW; R_BDS: R; DB_VALUE: 42k; DB_PCB_DEVICE: SMD_0603_RESC1608X55N; DB_PRICE_DATE: 2010-12-23; DB_APPROVED_BY: ISHIDDEN=T; DB_DATASHEET: http://john.epiqdesign.com/projects/CIS_Datasheets/PYu-RC0603_51_RoHS_L_4_YAGEO.pdf?rev=138&sc=0
R17 = RES000006287: DB_PART_TYPE: SMD; DB_MANUFACTURER_PART: YAGEO    RC0603FR-0730K; NOTE: <NOTE>; DB_T_RANGE: -55 to 155; DB_POWER: 1/10W; DB_PACKAGE: 0603; DB_DESCRIPTION: R SMD 30K 1% 1/10W 0603; DB_CERTIFIED: ISHIDDEN=T; DB_PRICE: 0.00063; DB_MOQ: 5000; DB_APPROVED_ON: 09.10.2010 г.; DB_STATUS: NEW; R_BDS: R; DB_PART_NUMBER: RES000006287; DB_VALUE: 30k; DB_PCB_DEVICE: SMD_0603_RESC1608X55N; DB_PRICE_DATE: 2010-12-23; DB_APPROVED_BY: ISHIDDEN=T; DB_DATASHEET: http://john.epiqdesign.com/projects/CIS_Datasheets/PYu-RC0603_51_RoHS_L_4_YAGEO.pdf?rev=138&sc=0
R27 = RES000008586: DB_PART_TYPE: SMD; DB_MANUFACTURER_PART: YAGEO       AC0603FR-072KL; NOTE: <NOTE>; DB_T_RANGE: -55 to 155; DB_POWER: 1/10W; DB_PACKAGE: 0603; DB_DESCRIPTION: R SMD 2k 1% 1/10W 0603; DB_CERTIFIED: AUT; DB_PRICE: ISHIDDEN=T; DB_APPROVED_BY: VSN; DB_APPROVED_ON: 03.5.2011 г. 11:15:27; DB_STATUS: NEW; R_BDS: R; DB_PART_NUMBER: RES000008586; DB_VALUE: 2k; DB_PCB_DEVICE: SMD_0603_RESC1608X55N; DB_LEADTIME: ISHIDDEN=T; DB_MOQ: ISHIDDEN=T; DB_PRICE_DATE: ISHIDDEN=T; DB_DATASHEET: http://john.epiqdesign.com/projects/CIS_Datasheets/RES_AC_YAGEO.pdf?rev=263&sc=0
TP2 TP5-TP7 TP10-TP13 TP18-TP25 TP123-TP129 TP131 TP132 = TPO000000001: DB_PART_TYPE: Test Point; DB_PACKAGE: ISHIDDEN=T; DB_DESCRIPTION: Test Point 100_254; DB_APPROVED_ON: 10.9.2010 г.; DB_STATUS: NEW; DB_PART_NUMBER: TPO000000001; DB_VALUE: 100_254; DB_DIAMETER: 100_254; DB_PCB_DEVICE: SMD_TP_100-254; DB_MANUFACTURER_PART: ISHIDDEN=T; DB_CERTIFIED: ISHIDDEN=T; DB_PRICE: ISHIDDEN=T; DB_LEADTIME: ISHIDDEN=T; DB_MOQ: ISHIDDEN=T; DB_PRICE_DATE: ISHIDDEN=T; DB_APPROVED_BY: ISHIDDEN=T; DB_DATASHEET: ISHIDDEN=T
U5 = PSU000000126: DB_PART_TYPE: Linear Voltage Regulator; DB_MANUFACTURER_PART: ROHM     BU33TD3WG-TR; DB_T_RANGE: -40 to 85; DB_VOLTAGE: 3.3V; DB_CURRENT: 200mA; DB_DROP_VOLTAGE: 220mV; DB_PACKAGE: SOT23-5; DB_DESCRIPTION: IC BU33TD3WG-TR SOT23-5; DB_CERTIFIED: ISHIDDEN=T; DB_APPROVED_BY: VSN; DB_APPROVED_ON: 07.5.2014 г. 13:14:31; DB_STATUS: NEW; DB_PART_NUMBER: PSU000000126; DB_VALUE: BU33TD3WG-TR; DB_PCB_DEVICE: SMD_SOT95P280X135-5N; DB_DATASHEET: http://john.epiqdesign.com/projects/CIS_Datasheets/IC_BUXXTD3WG-TR.pdf?rev=1407&sc=0; Assembly: N/A
U6 = PSU000000127: DB_PART_TYPE: Linear Voltage Regulator; DB_MANUFACTURER_PART: ROHM        BD33KA5WF-E2; DB_T_RANGE: -40 to 105; DB_VOLTAGE: 3.3V; DB_CURRENT: 500mA; DB_PACKAGE: SOIC-8; DB_DESCRIPTION: IC BD33KA5WF-E2 SOIC-8; DB_CERTIFIED: ISHIDDEN=T; DB_APPROVED_BY: VSN; DB_APPROVED_ON: 07.5.2014 г. 13:18:28; DB_STATUS: NEW; DB_PART_NUMBER: PSU000000127; DB_VALUE: BD33KA5WF-E2; DB_PCB_DEVICE: SMD_SOIC127P620X160-8N; DB_DATASHEET: http://john.epiqdesign.com/projects/CIS_Datasheets/IC_bdxxka5wf-e-209388.pdf?rev=1408&sc=0
U7 = PSU000000129: DB_PART_TYPE: Linear Voltage Regulator; DB_MANUFACTURER_PART: ST       L7805CD2T-TR; NOTE: <NOTE>; DB_T_RANGE: 0 to 125; DB_VOLTAGE: 5V; DB_CURRENT: 1A; DB_PACKAGE: D2PAK; DB_DESCRIPTION: IC  L7805CD2T-TR  D2PAK; DB_CERTIFIED: ISHIDDEN=T; DB_APPROVED_BY: VSN; DB_APPROVED_ON: 07.5.2014 г. 13:29:21; DB_STATUS: NEW; DB_PART_NUMBER: PSU000000129; DB_VALUE: L7805CD2T-TR; DB_PCB_DEVICE: SMD_TO254P1542X460-3_4N; DB_DATASHEET: http://john.epiqdesign.com/projects/CIS_Datasheets/IC_L7805C.pdf?rev=1409&sc=0; Assembly: N/A
U8 = PSU000000031: DB_PART_TYPE: Linear Voltage Regulator; DB_MANUFACTURER_PART: ON Semiconductor       MC78M05BDTRKG; NOTE: <NOTE>; DB_T_RANGE: -40 to 125; DB_VOLTAGE: 5V; DB_CURRENT: 500mA; DB_DROP_VOLTAGE: 2V; DB_PACKAGE: DPAK; DB_DESCRIPTION: IC  MC78M05BDTRKG  DPAK; DB_CERTIFIED: ISHIDDEN=T; DB_APPROVED_BY: VSN; DB_APPROVED_ON: 31.3.2011 г. 10:50:15; DB_STATUS: NEW; DB_PART_NUMBER: PSU000000031; DB_VALUE: MC78M05BDTRKG; DB_PCB_DEVICE: SMD_TO229P991X239-4N_DPAK; DB_PRICE: ISHIDDEN=T; DB_LEADTIME: ISHIDDEN=T; DB_MOQ: ISHIDDEN=T; DB_PRICE_DATE: ISHIDDEN=T; DB_DATASHEET: http://john.epiqdesign.com/projects/CIS_Datasheets/MC78M00-D_ONSEMI.pdf?rev=192&sc=0
U9 U29 = PSU000000128: DB_PART_TYPE: Linear Voltage Regulator; DB_MANUFACTURER_PART: ROHM        BD00KA5WF-E2; DB_T_RANGE: -40 to 105; DB_VOLTAGE: 3.3V; DB_CURRENT: 500mA; DB_PACKAGE: SOIC-8; DB_DESCRIPTION: IC BD00KA5WF-E2 SOIC-8; DB_CERTIFIED: ISHIDDEN=T; DB_APPROVED_BY: VSN; DB_APPROVED_ON: 07.5.2014 г. 13:19:57; DB_STATUS: NEW; DB_PART_NUMBER: PSU000000128; DB_PCB_DEVICE: SMD_SOIC127P620X160-8N; DB_DATASHEET: http://john.epiqdesign.com/projects/CIS_Datasheets/IC_bdxxka5wf-e-209388.pdf?rev=1408&sc=0
  U9: DB_VALUE: BD18KA5WF-E2
  U29: DB_VALUE: BD00KA5WF-E2
U10 = MCU000000070: DB_PART_TYPE: DSP; DB_MANUFACTURER_PART: MICROCHIP        DSPIC33EP256MU806-E/PT; OriginalSymbolOrigin: (30000,20000); < Value >: Type; DeviceNumbering: Alpha; DeviceDesignator: A; DevicesInPackage: 1; IsHeterogeneous: False; DB_T_RANGE: -40 to 125; DB_PACKAGE: TQFP-64; DB_DESCRIPTION: IC dsPIC33EP256MU806 TQFP-64; DB_CERTIFIED: AUT; DB_PRICE: ISHIDDEN=T; DB_APPROVED_BY: VSN; DB_APPROVED_ON: 17.7.2012 г. 14:21:28; DB_STATUS: NEW; Package: <Package>; DevicesInView: 1; PackageName: PIC24FJ16GA004_X_PT; DB_PART_NUMBER: MCU000000070; DB_VALUE: dsPIC33EP256MU806; DB_PCB_DEVICE: SMD_QFP50P1200X1200X120-64N; DB_LEADTIME: ISHIDDEN=T; DB_MOQ: ISHIDDEN=T; DB_PRICE_DATE: ISHIDDEN=T; DB_DATASHEET: http://john.epiqdesign.com/projects/CIS_Datasheets/dsPIC33EPxxx-Microchip.pdf?rev=798&sc=0
U27 U34 U35 = IC_TXB0302: DB_PCB_DEVICE: SMD_PSON40P120X180X40-8N; Assembly: N/A
U28 = PSU000000125: DB_PART_TYPE: Linear Voltage Regulator; DB_MANUFACTURER_PART: DIODES        AP78L05SG-13; DB_T_RANGE: -40 to 125; DB_VOLTAGE: 5V; DB_CURRENT: 100mA; DB_PACKAGE: SOIC-8; DB_DESCRIPTION: IC AP78L05SG-13 SOIC-8; DB_CERTIFIED: ISHIDDEN=T; DB_APPROVED_BY: VSN; DB_APPROVED_ON: 07.5.2014 г. 12:58:07; DB_STATUS: NEW; DB_PART_NUMBER: PSU000000125; DB_VALUE: AP78L05SG-13; DB_PCB_DEVICE: SMD_SOIC127P600X175-8N; DB_DATASHEET: http://john.epiqdesign.com/projects/CIS_Datasheets/IC_AP78LXX.pdf?rev=1405&sc=0; Assembly: N/A
Y1 = OSC000000012: DB_PART_TYPE: Oscillator; DB_MANUFACTURER_PART: IQD       4.00MHz HC49/4HSMX; NOTE: <NOTE>; DB_ACCURACY: 100ppm; DB_T_RANGE: -10 to 60; DB_FREQUENCY: 4MHz; DB_PACKAGE: SMD; DB_DESCRIPTION: IC  4.00MHz HC49/4HSMX  SMD; DB_CERTIFIED: ISHIDDEN=T; DB_APPROVED_BY: VSN; DB_APPROVED_ON: 26.4.2012 г. 15:32:29; DB_STATUS: NEW; DB_PART_NUMBER: OSC000000012; DB_VALUE: 4.00MHz HC49/4HSMX; DB_PCB_DEVICE: SMD_HC49_XTAL1140X480X420N; DB_PRICE: ISHIDDEN=T; DB_LEADTIME: ISHIDDEN=T; DB_MOQ: ISHIDDEN=T; DB_PRICE_DATE: ISHIDDEN=T; DB_DATASHEET: http://john.epiqdesign.com/projects/CIS_Datasheets/hc49-4hsmx_IQD_oscillators.pdf?rev=713&sc=0